# Altium schematic sheet [07] USB_HUB.SchDoc: 2-port USB 2.0 hub
size A4; Engineer: M. Folejewski; DocumentNumber: 7; SheetNumber: 7; SheetTotal: 15; PageSize: A4; Designators: 250-299
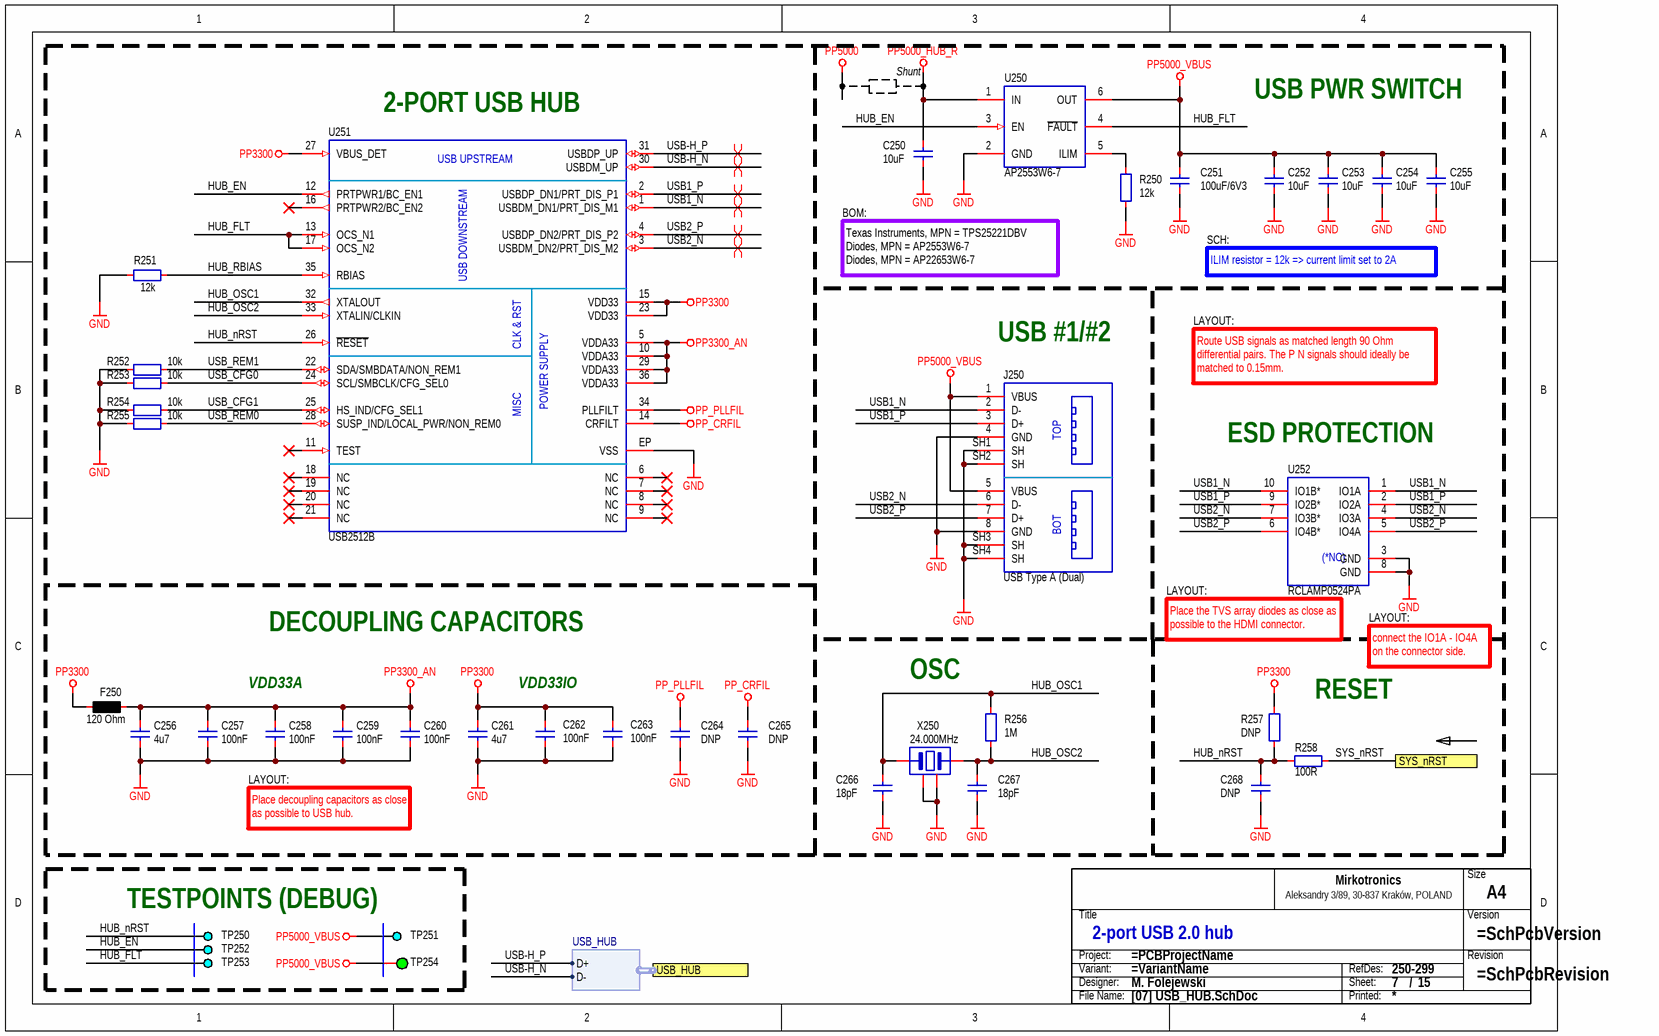
[diagram p0: [07] USB_HUB.SchDoc]

## Parts
C250  10uF  [CAP_0603_R]
C251  100uF/6V3  [CAP_1206_R]
C252  10uF  [CAP_0603_R]
C253  10uF  [CAP_0603_R]
C254  10uF  [CAP_0603_R]
C255  10uF  [CAP_0603_R]
C256  4u7  [CAP_0603_R]
C257  100nF  [CAP_0603_R]
C258  100nF  [CAP_0603_R]
C259  100nF  [CAP_0603_R]
C260  100nF  [CAP_0603_R]
C261  4u7  [CAP_0603_R]
C262  100nF  [CAP_0603_R]
C263  100nF  [CAP_0603_R]
C264  DNP  [CAP_0603_R]
C265  DNP  [CAP_0603_R]
C266  18pF  [CAP_0603_R]
C267  18pF  [CAP_0603_R]
C268  DNP  [CAP_0603_R]
F250  120 Ohm  [FER_0603_R]
J250  USB Type A (Dual)  [CON_USB_TYPE_A_2X]
R250  12k  [RES_0603_R]
R251  12k  [RES_0603_R]
R252  10k  [RES_0603_R]
R253  10k  [RES_0603_R]
R254  10k  [RES_0603_R]
R255  10k  [RES_0603_R]
R256  1M  [RES_0603_R]
R257  DNP  [RES_0603_R]
R258  100R  [RES_0603_R]
TB?  Title block  (value not drawn)  (graphical)
TP250  DEBUG  [PCB_TP_DBG_50]  (value not drawn)  (no BOM)
TP251  DEBUG  [PCB_TP_DBG_50]  (value not drawn)  (no BOM)
TP252  DEBUG  [PCB_TP_DBG_50]  (value not drawn)  (no BOM)
TP253  DEBUG  [PCB_TP_DBG_50]  (value not drawn)  (no BOM)
TP254  ICT  [PCB_TP_ICT_100]  (value not drawn)  (no BOM)
U250  AP2553W6-7  [PKG_SOT23-6]
U251  USB2512B  [ICC_QFN36_600X600X100_P50_EP_R]
U252  RCLAMP0524PA  [ICC_SLP2510P8_250X100X60_P50_R]
X250  24.000MHz  [OSC_3225_4P_R]

## Ports
SYS_nRST, USB_HUB (harness USB_HUB)

## Harnesses
USB_HUB: D+, D-

## Nets
GND: C250.1 C251.1 C252.1 C253.1 C254.1 C255.1 C256.1 C257.1 C258.1 C259.1 C260.1 C261.1 C262.1 C263.1 C264.1 C265.1 C266.1 C267.1 C268.1 J250.4(GND) J250.8(GND) J250.SH1(SH) J250.SH2(SH) J250.SH3(SH) J250.SH4(SH) R250.1 R251.1 R252.1 R253.1 R254.1 R255.1 U250.2(GND) U251.EP(VSS) U252.3(GND) U252.8(GND) X250.2 X250.4
PP3300: C261.2 C262.2 C263.2 F250.1 R257.2 U251.15(VDD33) U251.23(VDD33) U251.27(VBUS_DET)
PP3300_AN: C256.2 C257.2 C258.2 C259.2 C260.2 F250.2 U251.5(VDDA33) U251.10(VDDA33) U251.29(VDDA33) U251.36(VDDA33)
PP5000_HUB_R: C250.2 U250.1(IN)
PP5000_VBUS: C251.2 C252.2 C253.2 C254.2 C255.2 J250.1(VBUS) J250.5(VBUS) TP251.1 TP254.1 U250.6(OUT)
PP_CRFIL: C265.2 U251.14(CRFILT)
PP_PLLFIL: C264.2 U251.34(PLLFILT)
HUB_EN: TP252.1 U250.3(EN) U251.12(PRTPWR1/BC_EN1)
HUB_FLT: TP253.1 U250.4(~{FAULT}) U251.13(OCS_N1) U251.17(OCS_N2)
HUB_nRST: C268.2 R257.1 R258.1 TP250.1 U251.26(~{RESET})
HUB_OSC1: C266.2 R256.2 U251.32(XTALOUT) X250.1
HUB_OSC2: C267.2 R256.1 U251.33(XTALIN/CLKIN) X250.3
HUB_RBIAS: R251.2 U251.35(RBIAS)
SYS_nRST: R258.2 ; port SYS_nRST
USB1_N: J250.2(D-) U251.1(USBDM_DN1/PRT_DIS_M1) U252.1(IO1A) U252.10(IO1B*)
USB1_P: J250.3(D+) U251.2(USBDP_DN1/PRT_DIS_P1) U252.2(IO2A) U252.9(IO2B*)
USB2_N: J250.6(D-) U251.3(USBDM_DN2/PRT_DIS_M2) U252.4(IO3A) U252.7(IO3B*)
USB2_P: J250.7(D+) U251.4(USBDP_DN2/PRT_DIS_P2) U252.5(IO4A) U252.6(IO4B*)
USB-H_N: U251.30(USBDM_UP) ; port USB_HUB.D-
USB-H_P: U251.31(USBDP_UP) ; port USB_HUB.D+
USB_CFG0: R253.2 U251.24(SCL/SMBCLK/CFG_SEL0)
USB_CFG1: R254.2 U251.25(HS_IND/CFG_SEL1)
USB_REM0: R255.2 U251.28(SUSP_IND/LOCAL_PWR/NON_REM0)
USB_REM1: R252.2 U251.22(SDA/SMBDATA/NON_REM1)
NetR250_2: R250.2 U250.5(ILIM)

Not connected (* = marked no-connect by the designer): U251 6(NC)* 7(NC)* 8(NC)* 9(NC)* 11(TEST)* 16(PRTPWR2/BC_EN2)* 18(NC)* 19(NC)* 20(NC)* 21(NC)*

## Layout directives
differential pair: USB1_N, USB1_P, USB2_N, USB2_P, USB-H_N, USB-H_P

## Notes on the sheet
- (near U251) 2-PORT USB HUB
- Shunt
- USB PWR SWITCH
- BOM:
- SCH:
- Texas Instruments, MPN = TPS25221DBV
  Diodes, MPN = AP2553W6-7
  Diodes, MPN = AP22653W6-7
- ILIM resistor = 12k => current limit set to 2A
- (near J250) USB #1/#2
- Route USB signals as matched length 90 Ohm differential pairs. The P N signals should ideally be matched to 0.15mm.
- LAYOUT:
- (near U252) ESD PROTECTION
- DECOUPLING CAPACITORS
- (near U252) Place the TVS array diodes as close as possible to the HDMI connector.
- (near U252) LAYOUT:
- VDD33A
- VDD33IO
- (near R256) OSC
- RESET
- connect the IO1A - IO4A on the connector side.
- Place decoupling capacitors as close as possible to USB hub.
- TESTPOINTS (DEBUG)
- (in symbol CON-0009) TOP; BOT
- (in symbol ICC-0005) (*NC)
- (in symbol ICC_MCP_USB2512B_QFN36) USB UPSTREAM; USB DOWNSTREAM; CLK & RST; POWER SUPPLY; MISC
- (in symbol SCH_TITLE_BLOCK_MIRKOTRONICS_V2) Size; Mirkotronics; Aleksandry 3/89, 30-837 Kraków, POLAND; Title; Version; Project:; Revision; Variant:; RefDes:; Designer:; Sheet:; /; File Name:; Printed:

## Library data of the parts
C250 C252-C256 C261 = CAP-0023: Capacitor; MLCC; GENERIC; TBD; TBD; TBD; TBD; SMD; 0603 (1608);; Component Type: Capacitor; Component Subtype: MLCC; Manufacturer: GENERIC; MPN: GENERIC; Mounting Type: SMD; Package (Case): 0603 (1608); Supplier: ?
  C250 C252-C255: Value: 10uF
  C256 C261: Value: 4u7
C251 = CAP-0025: Capacitor; MLCC; GENERIC; TBD; TBD; TBD; TBD; SMD; 1206 (3216);; Component Type: Capacitor; Component Subtype: MLCC; Value: 100uF/6V3; Manufacturer: GENERIC; MPN: GENERIC; Mounting Type: SMD; Package (Case): 1206 (3216); Supplier: ?
C257-C260 C262 C263 = CAP-0008: Capacitor; MLCC; 100nF; TBD; TBD; TBD; TBD; SMD; 0603 (1608);; Component Type: Capacitor; Component Subtype: MLCC; Value: 100nF; Manufacturer: TBD; MPN: TBD; Mounting Type: SMD; Package (Case): 0603 (1608); Supplier: ?
C264 C265 C268 = CAP-0018: Capacitor; MLCC; DNP; TBD; TBD; TBD; DO NOT PLACE; SMD; 0603 (1608);; Component Type: Capacitor; Component Subtype: MLCC; Value: DNP; Manufacturer: DNP; MPN: DNP; Mounting Type: SMD; Package (Case): 0603 (1608); Supplier: ?
C266 C267 = CAP-0020: Capacitor; MLCC; 18pF; TBD; TBD; TBD; TBD; SMD; 0603 (1608);; Component Type: Capacitor; Component Subtype: MLCC; Value: 18pF; Manufacturer: TBD; MPN: TBD; Mounting Type: SMD; Package (Case): 0603 (1608); Supplier: ?
F250 = FIL-0001: Inductor; Ferrite Bead; 120 Ohm; 2000mA; TBD; TBD; TBD; SMD; 0603 (1608);; Component Type: Inductor; Component Subtype: Ferrite Bead; Value: 120 Ohm; Manufacturer: TBD; MPN: TBD; Mounting Type: SMD; Package (Case): 0603 (1608); Supplier: ?
J250 = CON-0009: Connector; USB Type A (Dual); 2 x 4 pins; TBD; TBD; TBD; TBD; THT; THT;; Component Type: Connector; Component Subtype: USB Type A (Dual); Value: USB Type A (Dual); Manufacturer: TBD; MPN: TBD; Mounting Type: THT; Package (Case): THT; Supplier: ?
R250 = RES-0054: Resistor; Thick Film; GENERIC; TBD; TBD; TBD; TBD; TBD; SMD; 0603 (1608);; Component Type: Resistor; Component Subtype: Thick Film; Value: 12k; Manufacturer: GENERIC; MPN: GENERIC; Mounting Type: SMD; Package (Case): 0603 (1608); Supplier: ?
R251 = RES-0053: Resistor; Thick Film; 12k; 1%; 100mW; 100PPM; 75V; Standard; SMD; 0603 (1608);; Manufacturer: Yageo Corporation; MPN: TBD; Component Type: Resistor; Component Subtype: Thick Film; Value: 12k; Mounting Type: SMD; Package (Case): 0603 (1608); Supplier: ?
R252-R255 = RES-0028: Resistor; Thick Film; 10k; 1%; 100mW; 100PPM; 75V; Standard; SMD; 0603 (1608);; Manufacturer: Yageo Corporation; MPN: RC0603FR-0710KL; Component Type: Resistor; Component Subtype: Thick Film; Value: 10k; Mounting Type: SMD; Package (Case): 0603 (1608); Supplier: ?
R256 = RES-0050: Resistor; Thick Film; 1M; 1%; 100mW; 100PPM; 75V; Standard; SMD; 0603 (1608);; Manufacturer: Yageo Corporation; MPN: TBD; Component Type: Resistor; Component Subtype: Thick Film; Value: 1M; Mounting Type: SMD; Package (Case): 0603 (1608); Supplier: ?
R257 = RES-0051: Resistor; Thick Film; DNP; TBD; TBD; TBD; TBD; DO NOT PLACE; SMD; 0603 (1608);; Component Type: Resistor; Component Subtype: Thick Film; Value: DNP; Manufacturer: TBD; MPN: TBD; Mounting Type: SMD; Package (Case): 0603 (1608); Supplier: ?
R258 = RES-0026: Resistor; Thick Film; 100R; 1%; 100mW; 100PPM; 75V; Standard; SMD; 0603 (1608);; Manufacturer: Yageo Corporation; MPN: TBD; Component Type: Resistor; Component Subtype: Thick Film; Value: 100R; Mounting Type: SMD; Package (Case): 0603 (1608); Supplier: ?
TB? = SCH_TITLE_BLOCK_MIRKOTRONICS_V2: Component Type: Title block; Manufacturer: -; Mounting Type: Non component; MPN: -; Operating Temperature: -; Package: -; Specification: Title block; Value: Title block; Replacement: -; System: ?
TP250-TP253 = PCB_TP_DBG: PCB Marking; Test Point (Debug);; Value: DEBUG; Component Subtype: -; Component Type: Testpoint; Mounting Type: -; Supplier: ?
TP254 = PCB_TP_ICT: Test Point (ICT); Specification: Testpoint (for ICT), SMD pad; Component Type: Testpoint (for ICT); Manufacturer: -; Mounting Type: Non component; MPN: -; Value: ICT
U250 = ICC_TXI_TPS25221_DBV: IC; Current Limited Switch;; Manufacturer: Diodes Incorporated; Package (Case): SOT26; MPN: AP2553W6-7; Value: AP2553W6-7; Component Subtype: Current Limited Switch; Component Type: IC; Mounting Type: SMD; Supplier: ?
U251 = ICC_MCP_USB2512B_QFN36: IC; USB Hub;; Manufacturer: Microchip Technology; Component Subtype: USB Hub; Component Type: IC; Mounting Type: SMD; MPN: USB2512B; Supplier: ?; Value: USB2512B
U252 = ICC-0005: IC; TVS Arrays; ESD Protection; 4-Channel; 17kV Air; 12kV Contact; 0.3pF Capitance; TBD; SMD; TBD;; Manufacturer: Semtech Corporation; MPN: RCLAMP0524PATCT; Component Type: IC; Component Subtype: TVS Arrays; Value: RCLAMP0524PA; Mounting Type: SMD; Package (Case): TBD; Supplier: ?
X250 = OSC_XTL_P4: Oscillator; Crystal;; Value: 24.000MHz; Component Subtype: Crystal; Component Type: Crystal; Mounting Type: SMD; Supplier: ?